# EAGLE design boomerang (EAGLE 6.4)
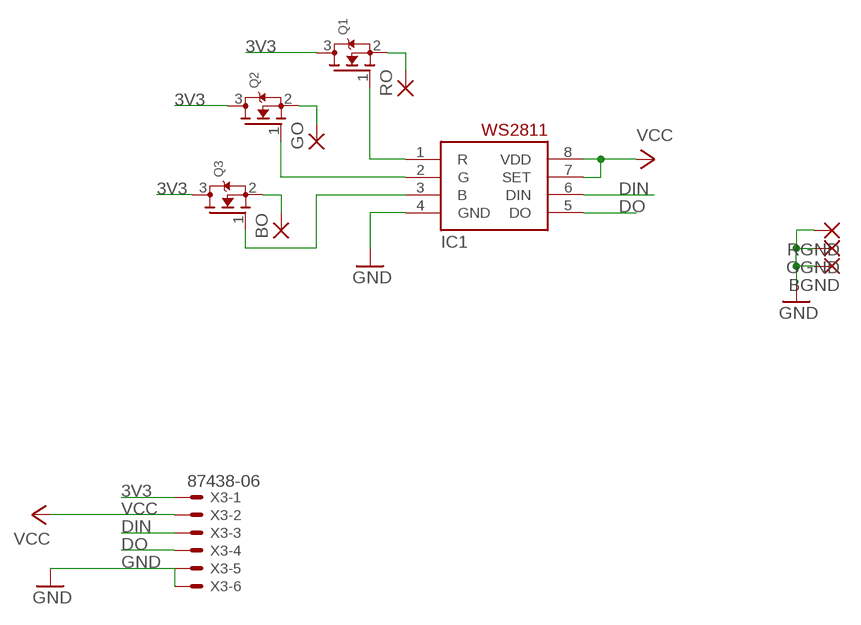
[diagram p0: schematic, sheet 1]

## Parts
BGND  SMD2  [SMD1,27-2,54]
BO  SMD2  [SMD1,27-2,54]
GGND  SMD2  [SMD1,27-2,54]
GO  SMD2  [SMD1,27-2,54]
IC1  WS2811-SOP8  [SO08-SKINNYPADS]
Q1  MOSFET-NREFLOW  [SOT23]
Q2  MOSFET-NREFLOW  [SOT23]
Q3  MOSFET-NREFLOW  [SOT23]
RGND  SMD2  [SMD1,27-2,54]
RO  SMD2  [SMD1,27-2,54]
X3  87438-06  [87438-06]

## Nets
3V3: Q1.3(D) Q2.3(D) Q3.3(D) X3.1
B: IC1.3(B) Q3.1(G)
BO: BO.1(P) Q3.2(S)
DIN: IC1.6(DIN) X3.3
DO: IC1.5(DO) X3.4
G: IC1.2(G) Q2.1(G)
GND: BGND.1(P) GGND.1(P) IC1.4(GND) RGND.1(P) X3.5 X3.6
GO: GO.1(P) Q2.2(S)
R: IC1.1(R) Q1.1(G)
RO: Q1.2(S) RO.1(P)
VCC: IC1.7(SET) IC1.8(VDD) X3.2

## Library data of the parts
BGND BO GGND GO RGND RO = wirepad:SMD2: SMD PAD
IC1 = adafruit:WS2811
Q1-Q3 = adafruit:MOSFET-N: N-Channel Mosfet 2N7002E - 60V 260mA SOT23 [Digikey: 2N7002ET1GOSTR-ND] - REEL BSH103 - 30V 850mA SOT23 [Digikey: 568-5013-1-ND]
X3 = con-molex:87438-06: Wire-to-Board 1.50mm (.059") Pitch Header - Right Angle, SMT, Shrouded Source: http://www.molex.com/product/micro/87438.html; MPN: 87438-0643; OC_FARNELL: 1756938; OC_NEWARK: 88K3155

## Board
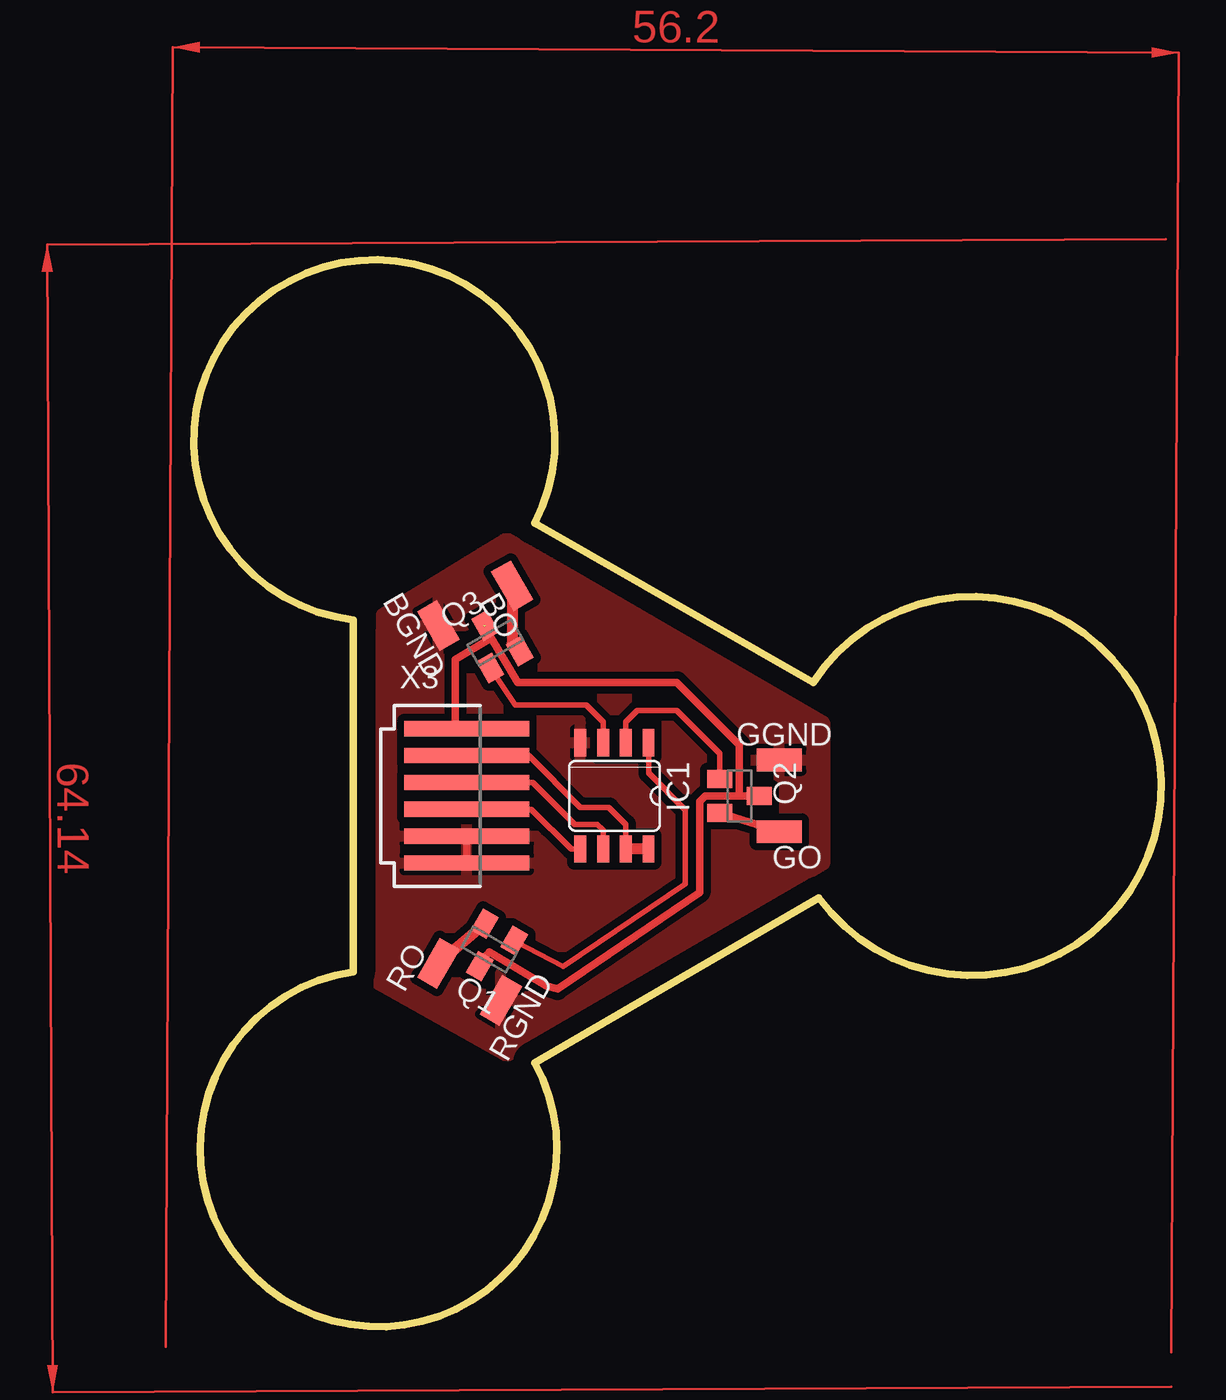
[diagram p1: board, top side]

Size 54.07 x 59.63 mm. Coordinates in mm from the lower left corner, seen from the top.
Outline: 8.9,39.51 arc-291 19.06,44.91 34.62,36.02 arc-291 34.94,23.96 19.06,14.75 arc-291 8.9,19.83 8.9,39.51
Copper layers (1*16): Top 0.035mm / dielectric 1.5mm / Bottom 0.035mm
Design rules "default": minimum track width 10mil, minimum drill 24mil, track to track 8mil, track to pad 8mil, pad to pad 8mil, via to via 8mil, smd to smd 8mil, copper to edge 40mil, drill to drill 8mil, minimum pad ring 10mil, minimum via ring 8mil, stop-mask expansion 4mil, vias tented up to drill 0mil, thermal gap 10mil

### Footprints (pad centres in the part's own frame; a part is rotated, then mirrored left to right if it is on the bottom)
SMD1,27-2,54 = smd 1.27 x 2.54: 1 0,0
SO08-SKINNYPADS = smd 0.66 x 1.524: 1 -1.905,-2.973; 2 -0.635,-2.973; 3 0.635,-2.973; 4 1.905,-2.973; 5 1.905,2.973; 6 0.635,2.973; 7 -0.635,2.973; 8 -1.905,2.973
SOT23 = smd 1 x 1.4: 1 -0.95,-1.1; 2 0.95,-1.1; 3 0,1.1
87438-06 = smd 7 x 0.85: 1 0,3.75; 2 0,2.25; 3 0,0.75; 4 0,-0.75; 5 0,-2.25; 6 0,-3.75

### Placement (x,y rotation side)
BGND  13.67,39.2 30 top
BO  17.79,41.42 30 top
GGND  32.72,31.67 270 top
GO  32.72,27.67 90 top
IC1  23.51,29.67 180 top
Q1  16.52,21.1 150 top
Q2  30.49,29.67 270 top
Q3  16.84,38.24 30 top
RGND  17.16,18.24 150 top
RO  13.67,20.3 330 top
X3  15.25,29.67 0 top

### Tracks (layer width: path | path; a pad name or v marks a point on that pad's centre or on a via)
3V3  (1 unrouted)
  Top 0.406: X3.1 17.73,33.48 14.62,33.48 14.62,37.29 16.63,38.5 | Q2.3 30.49,29.67 | 30.49,29.67 28.59,29.67 28.27,29.35 28.27,24.27 20.33,18.88 19.7,19.03 16.52,20.94 16.37,20.78 Q1.3 | 16.21,39.2 16.63,38.5 | 16.63,38.5 18.11,36.02 27,36.02 30.49,32.53 30.49,29.67
B
  Top 0.305: Q3.1 17.95,34.75 21.92,34.75 22.87,33.8 IC1.3
BO
  Top 0.61: BO.1 17.79,38.19 Q3.2
DIN
  Top 0.305: IC1.6 22.87,27.77 22.56,28.08 21.29,28.08 18.95,30.42 X3.3
DO
  Top 0.305: IC1.5 21.09,26.7 18.86,28.92 X3.4
G
  Top 0.305: IC1.2 24.14,33.8 24.78,34.43 27,34.43 29.39,32.04 Q2.1
GND
  Top 0.406: X3.5 X3.6
  pour Top (isolate 0.406): 17.48,44.12 35.26,33.8 35.26,25.86 17.48,15.07 10.17,19.19 10.49,39.83 16.21,43.32
GO
  Top 0.406: GO.1 Q2.2
R
  Top 0.305: IC1.1 25.41,30.94 27.48,28.88 27.48,24.75 20.65,20.15 Q1.1
RO
  Top 0.61: RO.1 Q1.2
VCC
  Top 0.305: IC1.7 24.14,28.08 23.19,29.04 21.6,29.04 18.72,31.92 X3.2
  Top 0.61: IC1.8 IC1.7
(copper drawn outside any net)
  shapes: Top area x2